# Altium schematic sheet [13]-BACKUP_POWER.SchDoc
size A4
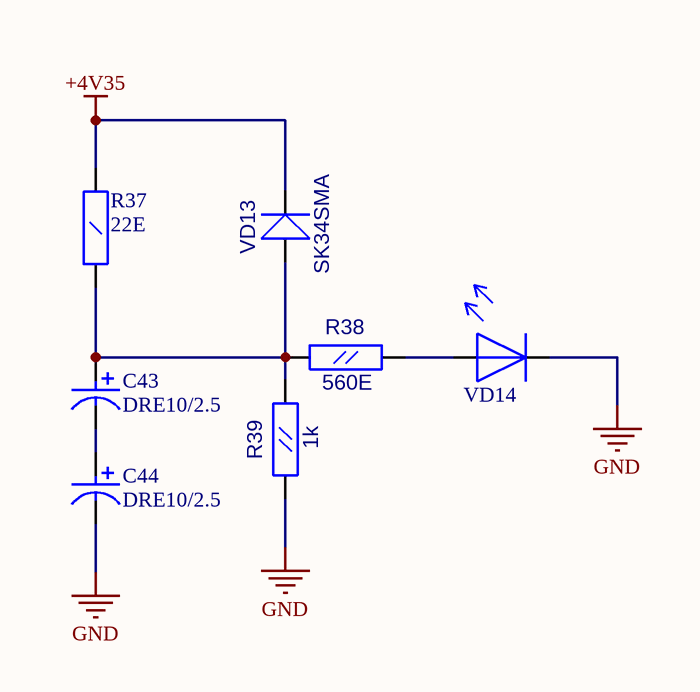
[diagram p0: [13]-BACKUP_POWER.SchDoc]

## Parts
C43  DRE10/2.5  [CAP_13x26]
C44  DRE10/2.5  [CAP_13x26]
R37  22E  [R2512]
R38  560E  [RC0603]
R39  1k  [RC0603]
VD13  SK34SMA  [SMA]
VD14  LED_0805  [LED0805]  (value not drawn)

## Nets
+4V35: R37.2(B) VD13.2(K)
GND: C44.1 R39.1(A) VD14.2
NetC43_1: C43.1 C44.2
NetC43_2: C43.2 R37.1(A) R38.1(A) R39.2(B) VD13.1(A)
NetR38_2: R38.2(B) VD14.1

## Library data of the parts
C43 C44 = SUPERCAP_10F: Value: DRE10/2.5
R37 = RC2512: Resistor 2512 1W; Value: 22E
R38 R39 = RC0603
  R38: Value: 560E
  R39: Value: 1k
VD13 = SK34SMA: Schottky Rectifier; Value: {Value}
VD14 = LED_0805: Value: LED_0805